# Altium project openmv-ae3.PrjPcb (part 2 of 2)

## Sheet wifi-bt.SchDoc
size A
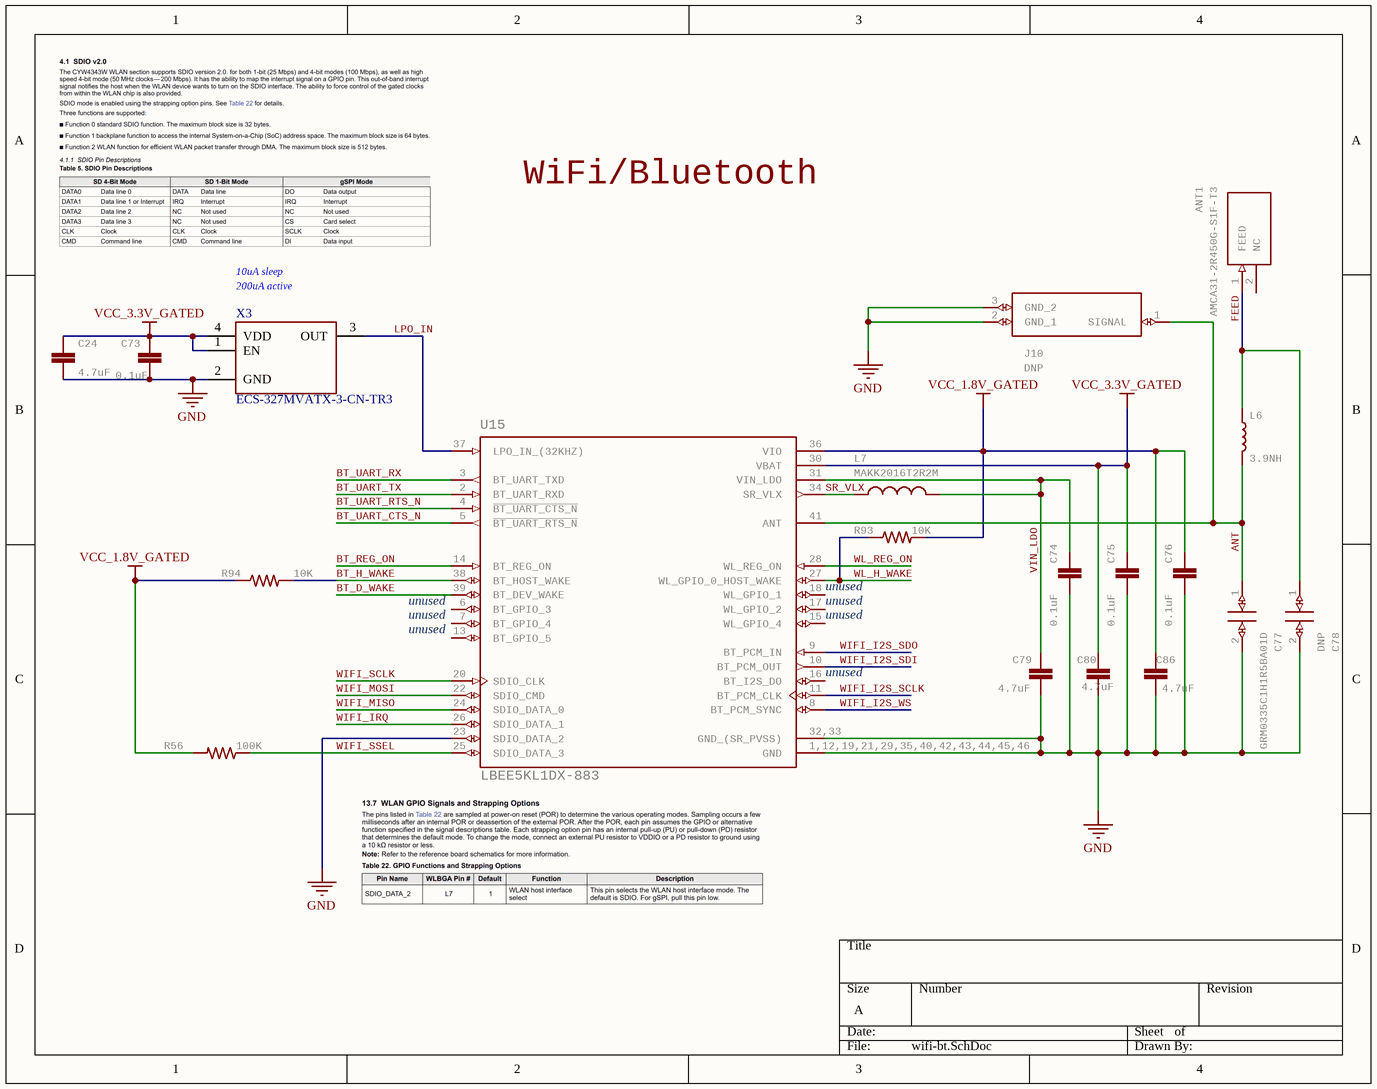
[diagram p13: wifi-bt.SchDoc]

### Parts
ANT1  AMCA31-2R450G-S1F-T3  [ANTC3216X140N]
C24  4.7uF  [0402-CAP]
C73  0.1uF  [0402-CAP]
C74  0.1uF  [0402-CAP]
C75  0.1uF  [0402-CAP]
C76  0.1uF  [0402-CAP]
C77  GRM0335C1H1R5BA01D  [CAPC0603X33N]
C78  DNP  [C0201-NO-3D]
C79  4.7uF  [0402-CAP]
C80  4.7uF  [0402-CAP]
C86  4.7uF  [0402-CAP]
J10  DNP  [23370191-NO-3D]
L6  3.9NH  [0402]
L7  MAKK2016T2R2M  [INDC2016X100N]
R56  100K  [0402-RES]
R93  10K  [0402-RES]
R94  10K  [0402-RES]
U15  LBEE5KL1DX-883  [XCVR_LBEE5KL1DX-TEMP]
X3  ECS-327MVATX-3-CN-TR3  [XTAL_3225]

### Nets
GND: C24.1 C73.2 C74.2 C75.2 C76.2 C77.2 C78.2 C79.1 C80.1 C86.1 J10.2(GND_1) J10.3(GND_2) U15.1,12,19,21,29,35,40,42,43,44,45,46(GND) U15.23(SDIO_DATA_2) U15.32,33(GND_(SR_PVSS)) X3.2(GND)
VCC_1.8V_GATED: C76.1 C86.2 R56.2 R93.2 R94.1 U15.36(VIO)
VCC_3.3V_GATED: C24.2 C73.1 C75.1 C80.2 U15.30(VBAT) X3.1(EN) X3.4(VDD)
ANT: C77.1 J10.1(SIGNAL) L6.2 U15.41(ANT)
BT_D_WAKE: U15.39(BT_DEV_WAKE)
BT_H_WAKE: R94.2 U15.38(BT_HOST_WAKE)
BT_REG_ON: U15.14(BT_REG_ON)
BT_UART_CTS_N: U15.5(~{BT_UART_RTS_N})
BT_UART_RTS_N: U15.4(~{BT_UART_CTS_N})
BT_UART_RX: U15.3(BT_UART_TXD)
BT_UART_TX: U15.2(BT_UART_RXD)
FEED: ANT1.1(FEED) C78.1 L6.1
LPO_IN: U15.37(LPO_IN_(32KHZ)) X3.3(OUT)
SR_VLX: L7.1 U15.34(SR_VLX)
VIN_LDO: C74.1 C79.2 L7.2 U15.31(VIN_LDO)
WIFI_I2S_SCLK: U15.11(BT_PCM_CLK)
WIFI_I2S_SDI: U15.10(BT_PCM_OUT)
WIFI_I2S_SDO: U15.9(BT_PCM_IN)
WIFI_I2S_WS: U15.8(BT_PCM_SYNC)
WIFI_IRQ: U15.26(SDIO_DATA_1)
WIFI_MISO: U15.24(SDIO_DATA_0)
WIFI_MOSI: U15.22(SDIO_CMD)
WIFI_SCLK: U15.20(SDIO_CLK)
WIFI_SSEL: R56.1 U15.25(SDIO_DATA_3)
WL_H_WAKE: R93.1 U15.27(WL_GPIO_0_HOST_WAKE)
WL_REG_ON: U15.28(WL_REG_ON)

Not connected (* = marked no-connect by the designer): ANT1 2(NC); U15 6(BT_GPIO_3) 7(BT_GPIO_4) 13(BT_GPIO_5) 15(WL_GPIO_4) 16(BT_I2S_DO) 17(WL_GPIO_2) 18(WL_GPIO_1)

### Notes on the sheet
- WiFi/Bluetooth
- 10uA sleep
- (near X3) 200uA active
- (near U15) unused
- unused

### Library data of the parts
ANT1 = AMCA31-2R450G-S1F-T3: ABRACON - AMCA31-2R450G-S1F-T3 - ANTENNA, CHIP, 2.45GHZ, 50 OHM, 1206   Source:  Datasheet; GateName_1: G$1; SymbolName_1: AMCA31-2R450G-S1F-T3; LibraryName: AMCA31-2R450G-S1F-T3; DeviceSetName: AMCA31-2R450G-S1F-T3; HEIGHT: 1.4mm; MANUFACTURER_NAME: ABRACON; MANUFACTURER_PART_NUMBER: AMCA31-2R450G-S1F-T3; MOUSER_PART_NUMBER: 815-CA312R450GS1FT3; MOUSER_PRICE-STOCK: https://www.mouser.co.uk/ProductDetail/ABRACON/AMCA31-2R450G-S1F-T3?qs=AAveGqk956GLuOddQEK40Q%3D%3D; MPN: AMCA31-2R450G-S1F-T3; Part Number: AMCA31-2R450G-S1F-T3
C24 C79 C80 C86 = CAP0402-CAP: as C30 on sheet usb; DeviceName: 0402-CAP; LibraryName: sfe; DeviceSetName: CAP; Part Number: JMK105BBJ475MV-F
C73-C76 = C-EUC0201: CAPACITOR, European symbol; MPN: C0402C104Z4VAC; GateName_1: G$1; SymbolName_1: C-EU; POPULARITY: 0; LibraryName: rcl; DeviceSetName: C-EU; SPICEPREFIX: C; Part Number: C0402C104Z4VAC
C77 = GRM0335C1H1R5BA01D: Chip Capacitor value 1R5   Source:  Datasheet; MANUFACTURER_NAME: Murata Electronics; GateName_1: G$1; SymbolName_1: GRM0335C1H1R5BA01D; LibraryName: GRM0335C1H1R5BA01D; DeviceSetName: GRM0335C1H1R5BA01D; HEIGHT: 0.33mm; MANUFACTURER_PART_NUMBER: GRM0335C1H1R5BA01D; MOUSER_PART_NUMBER: 81-GRM0335C1H1R5BA1D; MOUSER_PRICE-STOCK: https://www.mouser.co.uk/ProductDetail/Murata-Electronics/GRM0335C1H1R5BA01D?qs=7vGxPDjevFPFqveGwv%252BPUQ%3D%3D; MPN: GRM0335C1H1R5BA01D; Part Number: GRM0335C1H1R5BA01D
C78 = GRM0335C1H1R5BA01D: Chip Capacitor value 1R5   Source:  Datasheet; MANUFACTURER_NAME: Murata Electronics; GateName_1: G$1; POPULATE: 0; SymbolName_1: GRM0335C1H1R5BA01D; LibraryName: GRM0335C1H1R5BA01D; DeviceSetName: GRM0335C1H1R5BA01D; HEIGHT: 0.33mm; MANUFACTURER_PART_NUMBER: GRM0335C1H1R5BA01D; MOUSER_PART_NUMBER: 81-GRM0335C1H1R5BA1D; MOUSER_PRICE-STOCK: https://www.mouser.co.uk/ProductDetail/Murata-Electronics/GRM0335C1H1R5BA01D?qs=7vGxPDjevFPFqveGwv%252BPUQ%3D%3D; MPN: DNP; Part Number: DNP
J10 = 2337019-1: RF Connectors / Coaxial Connectors MicroCoax receptacle UMCC Gen 1   Source:  Datasheet; MANUFACTURER_NAME: TE Connectivity; GateName_1: G$1; POPULATE: 0; SymbolName_1: 2337019-1; LibraryName: 2337019-1; DeviceSetName: 2337019-1; HEIGHT: 1.4mm; MANUFACTURER_PART_NUMBER: 2337019-1; MOUSER_PART_NUMBER: 571-2337019-1; MOUSER_PRICE-STOCK: https://www.mouser.co.uk/ProductDetail/TE-Connectivity/2337019-1?qs=l4Gc20tDgJIuN7nS9rJkJw%3D%3D; MPN: DNP; Part Number: DNP
L6 = INDUCTOR-0402-3.9NH: Inductors    Resist changes in electrical current. Basically a coil of wire.   SparkFun Products:  SparkFun Load Cell Amplifier - HX711  IOIO-OTG - V2.2; MPN: L-07C3N9SV6T; GateName_1: G$1; PROD_ID: NDUC-13457; SymbolName_1: INDUCTOR; DeviceName: -0402-3.9NH; LibraryName: SparkFun-Coils; DeviceSetName: INDUCTOR; Part Number: L-07C3N9SV6T
L7 = MAKK2016T2R2M: INDUCTOR, METAL CORE Check availability; GateName_1: G$1; MF: Taiyo Yuden; SymbolName_1: MAKK2016T2R2M; LibraryName: MAKK2016T2R2M; DeviceSetName: MAKK2016T2R2M; AVAILABILITY: In Stock; MP: MAKK2016T2R2M; MPN: MAKK2016T2R2M; PACKAGE: 2016 Taiyo Yuden; PRICE: None; PURCHASE-URL: https://pricing.snapeda.com/search/part/MAKK2016T2R2M/?ref=eda; Part Number: MAKK2016T2R2M
R56 = RESISTOR0402-RES: as R29 on sheet prg-flash; SymbolName_1: RESISTOR; DeviceName: 0402-RES; LibraryName: sfe; DeviceSetName: RESISTOR; Part Number: AC0402FR-07100KL
R93 R94 = RESISTOR0402-RES: ResistorBasic schematic elements and footprints for 0603, 1206, and PTH resistors.; MPN: AC0402FR-1310K; GateName_1: G$1; SymbolName_1: RESISTOR; DeviceName: 0402-RES; LibraryName: sfe; DeviceSetName: RESISTOR; Part Number: AC0402FR-1310K
U15 = LBEE5KL1DX-TEMP: Broadcom Chipset for 802.11b/g/n + Bluetooth 4.1/EDR; GateName_1: G$1; MF: Murata Electronics; SymbolName_1: LBEE5KL1DX-TEMP; LibraryName: LBEE5KL1DX-TEMP; DeviceSetName: LBEE5KL1DX-TEMP; AVAILABILITY: Unavailable; MP: LBEE5KL1DX-TEMP; MPN: LBEE5KL1DX-883; PACKAGE: None; PRICE: None; Part Number: LBEE5KL1DX-883
X3 = ECS-327MVATX-3-CN-TR3: Part Number: ECS-327MVATX-3-CN-TR3; MPN: ECS-327MVATX-3-CN-TR3

## Sheet mic.SchDoc
size A
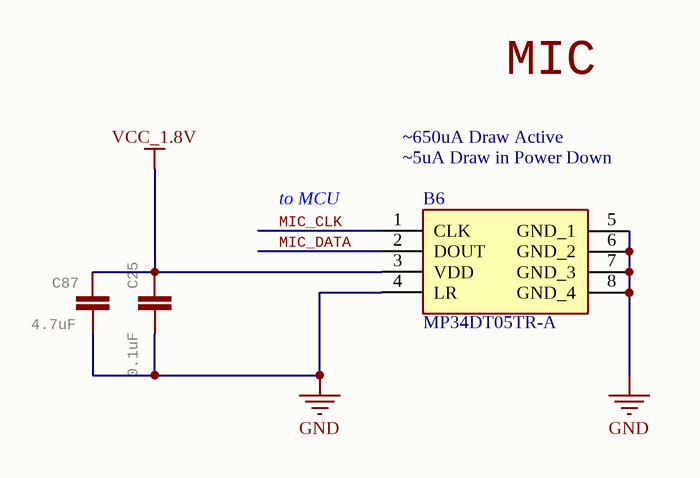
[diagram p14: mic.SchDoc]

### Parts
B6  MP34DT05TR-A  [MP34DT05TRA]
C25  0.1uF  [0402-CAP]
C87  4.7uF  [0402-CAP]

### Nets
GND: B6.4(LR) B6.5(GND_1) B6.6(GND_2) B6.7(GND_3) B6.8(GND_4) C25.2 C87.1
VCC_1.8V: B6.3(VDD) C25.1 C87.2
MIC_CLK: B6.1(CLK)
MIC_DATA: B6.2(DOUT)

### Notes on the sheet
- (near B6) ~5uA Draw in Power Down
- ~650uA Draw Active
- MIC
- to MCU

### Library data of the parts
B6 = MP34DT05TR-A: STMICROELECTRONICS - MP34DT05TR-A - MEMS MICROPHONE, 3.6V, HCLGA-4; Geometry.Height: 1mm; Mouser Part Number: 511-MP34DT05TR-A; Mouser Price/Stock: https://www.mouser.co.uk/ProductDetail/STMicroelectronics/MP34DT05TR-A?qs=BZBei1rCqCAMJfcA0UxAnA%3D%3D; Manufacturer_Name: STMicroelectronics; Manufacturer_Part_Number: MP34DT05TR-A; Datasheet Link: http://www.st.com/content/ccc/resource/technical/document/datasheet/group3/c7/90/d3/f6/b7/e7/40/c8/DM00415595/files/DM00415595.pdf/jcr:content/translations/en.DM00415595.pdf; Part Number: MP34DT05TR-A; MPN: MP34DT05TR-A
C25 = C-EUC0201: as C73 on sheet wifi-bt; LibraryName: rcl; DeviceSetName: C-EU; SPICEPREFIX: C; Part Number: C0402C104Z4VAC
C87 = CAP0402-CAP: as C30 on sheet usb; DeviceName: 0402-CAP; LibraryName: sfe; DeviceSetName: CAP; Part Number: JMK105BBJ475MV-F

## Sheet ae302f.SchDoc
size C
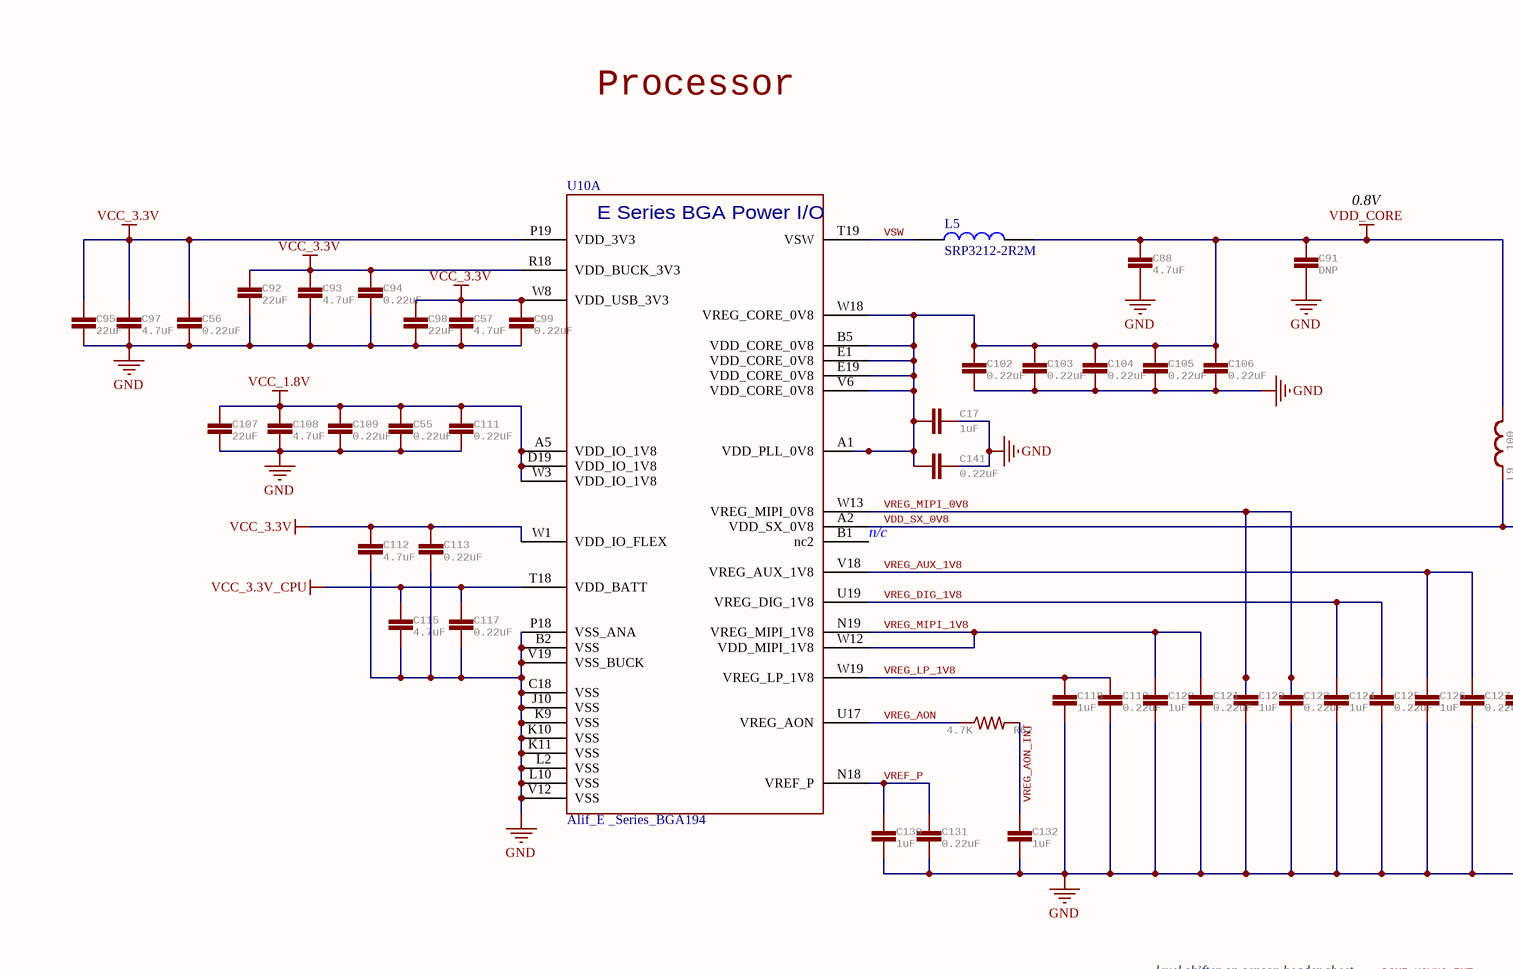
[diagram p15: ae302f.SchDoc, top left]
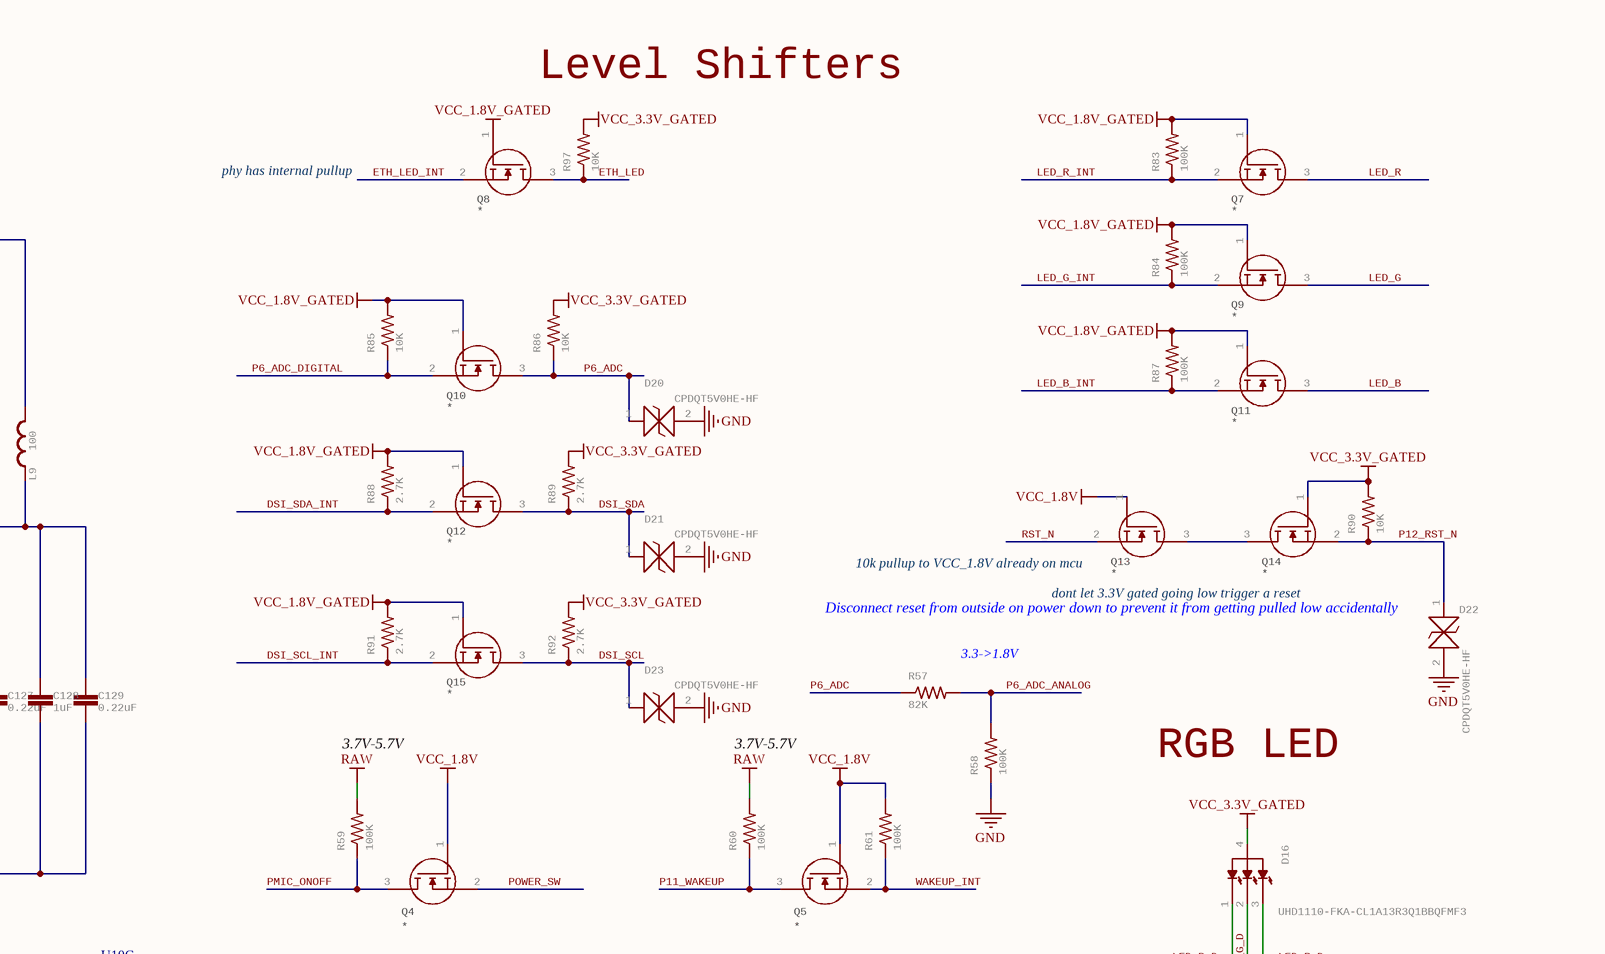
[diagram p16: ae302f.SchDoc, top right]
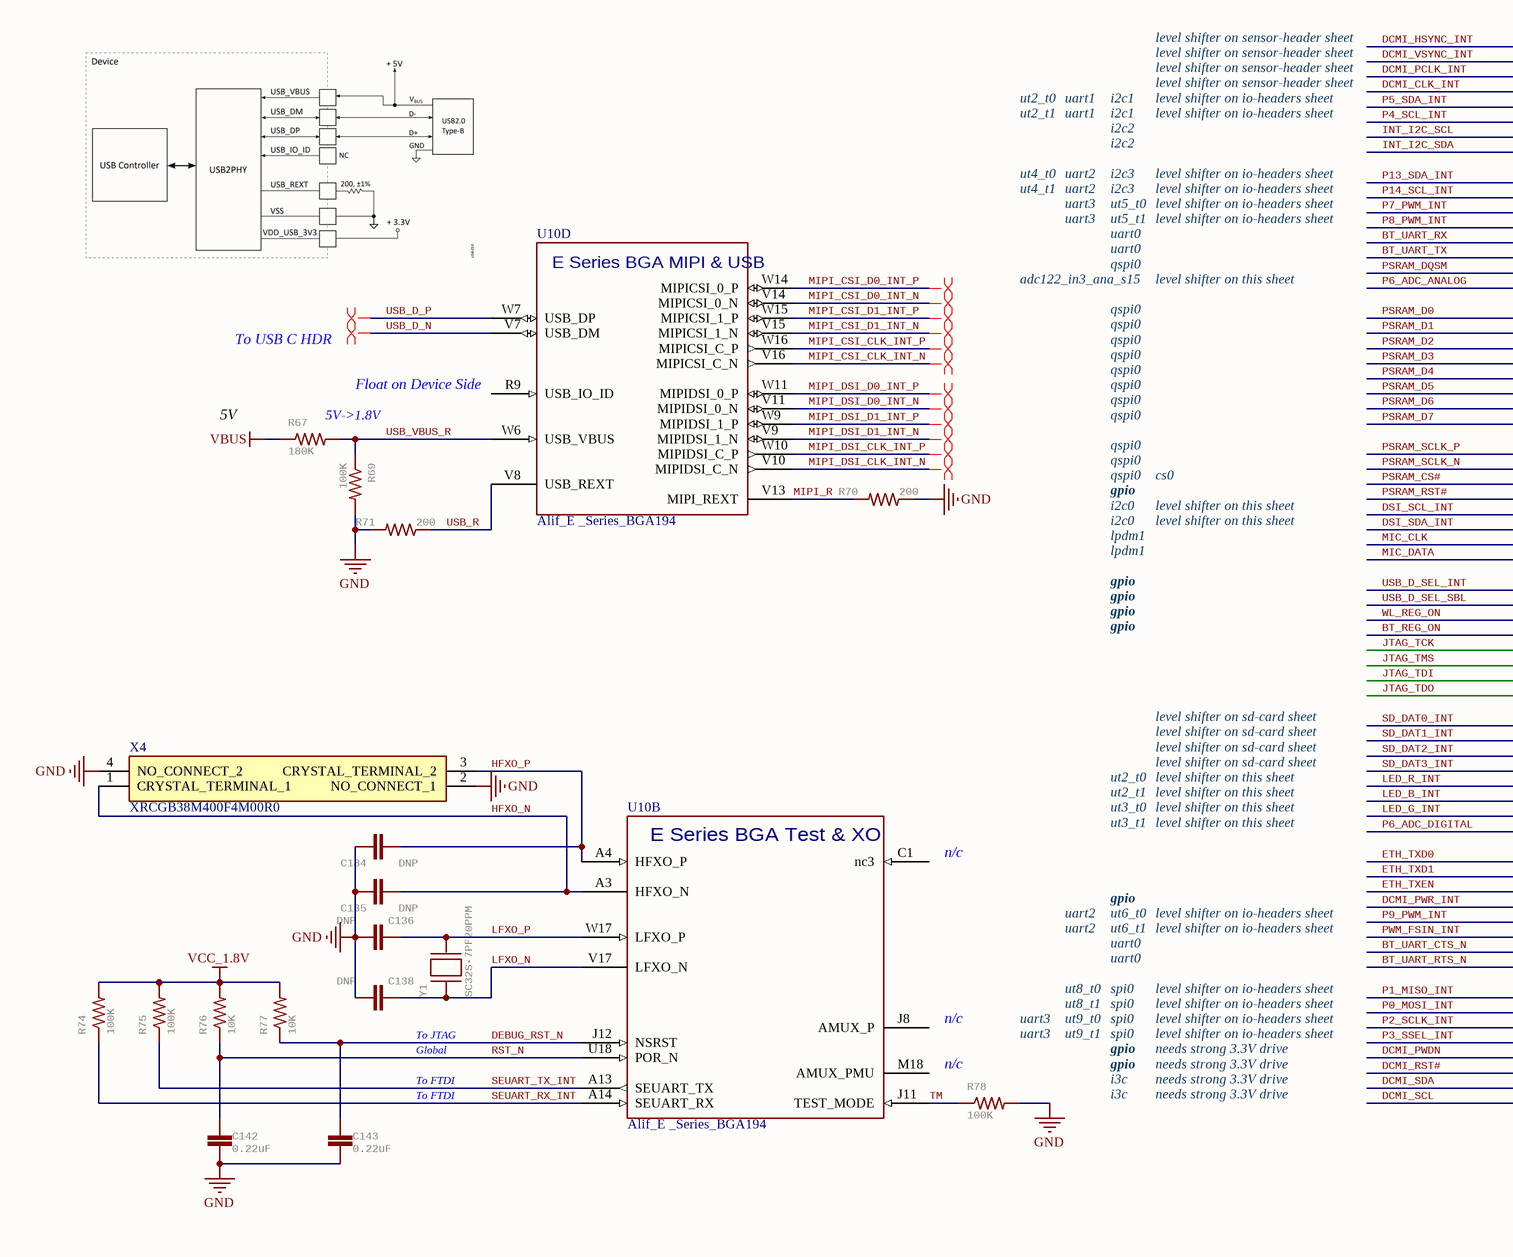
[diagram p17: ae302f.SchDoc, bottom left]
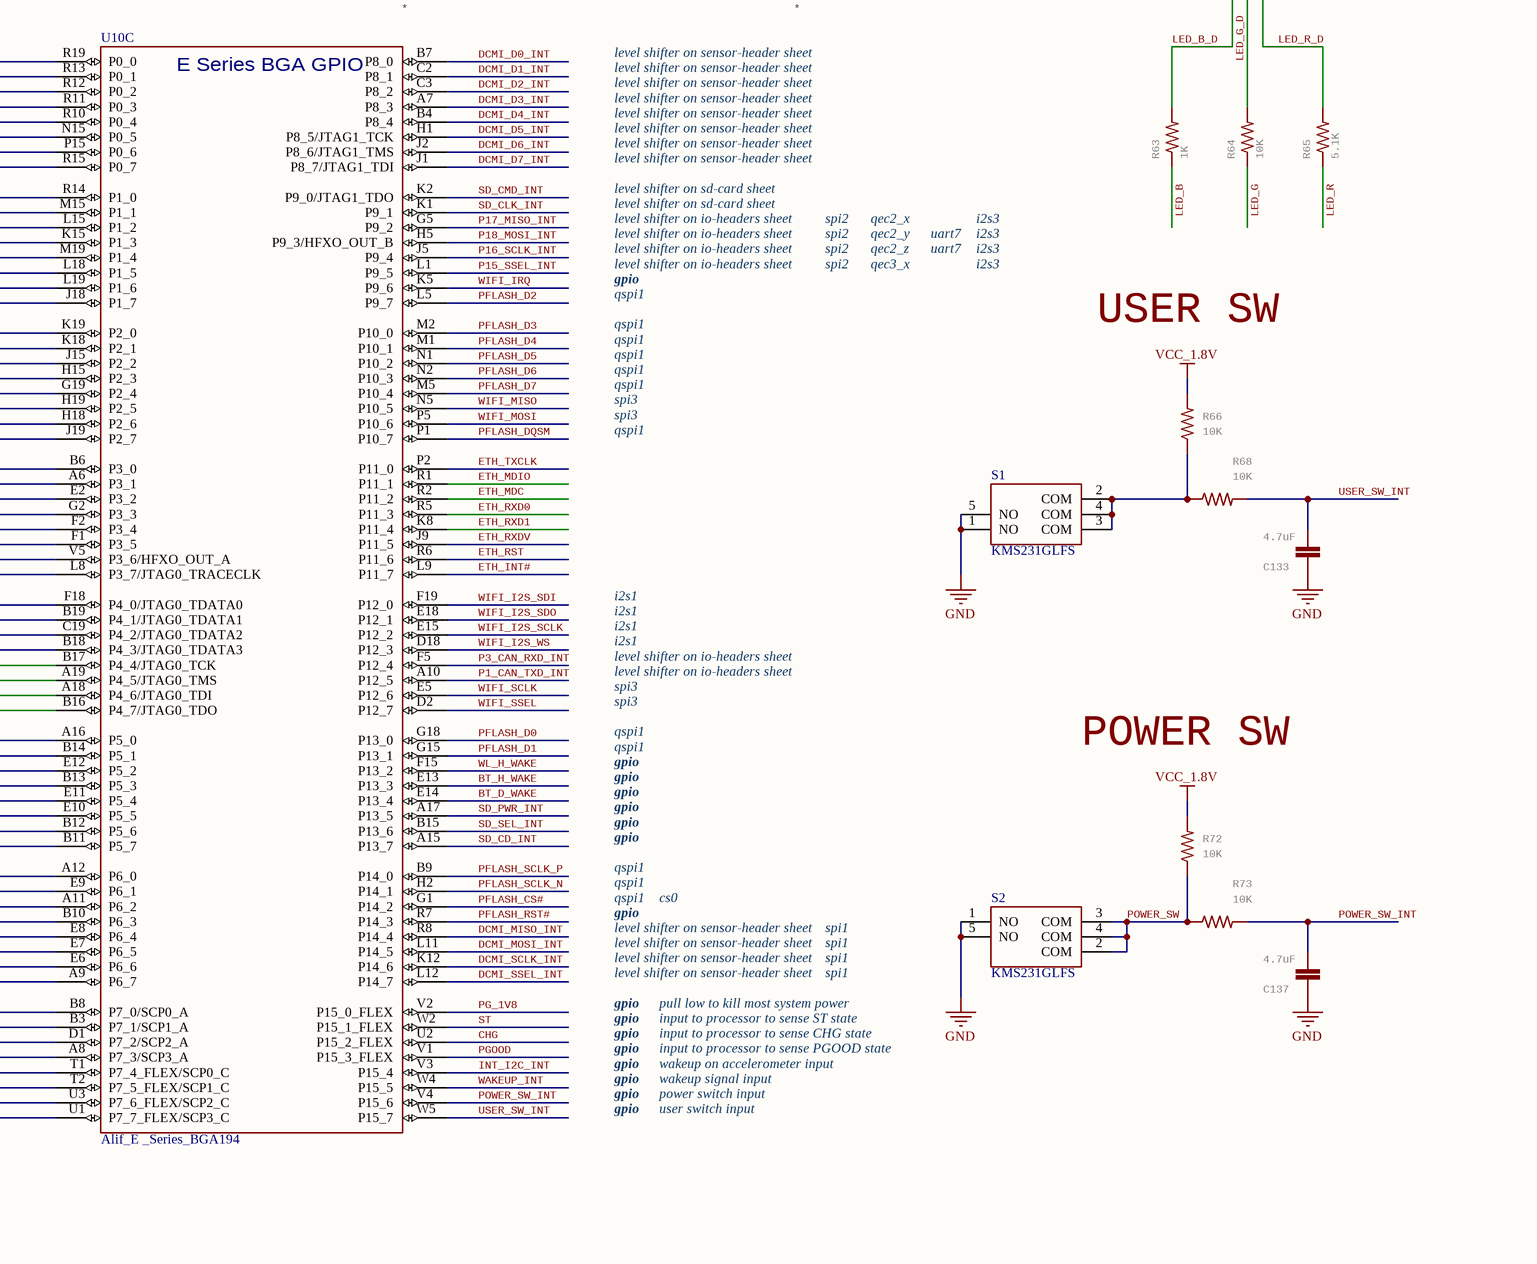
[diagram p18: ae302f.SchDoc, bottom right]

### Parts
C17  1uF  [0402-CAP]
C55  0.22uF  [C0201]
C56  0.22uF  [C0201]
C57  4.7uF  [0402-CAP]
C88  4.7uF  [0402-CAP]
C91  DNP  [0805]
C92  22uF  [0805]
C93  4.7uF  [0402-CAP]
C94  0.22uF  [C0201]
C95  22uF  [0805]
C97  4.7uF  [0402-CAP]
C98  22uF  [0805]
C99  0.22uF  [C0201]
C102  0.22uF  [C0201]
C103  0.22uF  [C0201]
C104  0.22uF  [C0201]
C105  0.22uF  [C0201]
C106  0.22uF  [C0201]
C107  22uF  [0805]
C108  4.7uF  [0402-CAP]
C109  0.22uF  [C0201]
C111  0.22uF  [C0201]
C112  4.7uF  [0402-CAP]
C113  0.22uF  [C0201]
C115  4.7uF  [0402-CAP]
C117  0.22uF  [C0201]
C118  1uF  [0402-CAP]
C119  0.22uF  [C0201]
C120  1uF  [0402-CAP]
C121  0.22uF  [C0201]
C122  1uF  [0402-CAP]
C123  0.22uF  [C0201]
C124  1uF  [0402-CAP]
C125  0.22uF  [C0201]
C126  1uF  [0402-CAP]
C127  0.22uF  [C0201]
C128  1uF  [0402-CAP]
C129  0.22uF  [C0201]
C130  1uF  [0402-CAP]
C131  0.22uF  [C0201]
C132  1uF  [0402-CAP]
C133  4.7uF  [0402-CAP]
C134  DNP  [C0201]
C135  DNP  [C0201]
C136  DNP  [C0201]
C137  4.7uF  [0402-CAP]
C138  DNP  [C0201]
C141  0.22uF  [C0201]
C142  0.22uF  [C0201]
C143  0.22uF  [C0201]
D16  UHD1110-FKA-CL1A13R3Q1BBQFMF3  [LED_UHD1110-FKA-CL1A13R3Q1BBQFMF3]
D20  CPDQT5V0HE-HF  [CPDQT5V0HEHF]
D21  CPDQT5V0HE-HF  [CPDQT5V0HEHF]
D22  CPDQT5V0HE-HF  [CPDQT5V0HEHF]
D23  CPDQT5V0HE-HF  [CPDQT5V0HEHF]
L5  SRP3212-2R2M  [IND3225X100N]
L9  100  [C0402]
Q4  NMOS  [DFN1006]  (value not drawn)
Q5  NMOS  [DFN1006]  (value not drawn)
Q7  NMOS  [DFN1006]  (value not drawn)
Q8  NMOS  [DFN1006]  (value not drawn)
Q9  NMOS  [DFN1006]  (value not drawn)
Q10  NMOS  [DFN1006]  (value not drawn)
Q11  NMOS  [DFN1006]  (value not drawn)
Q12  NMOS  [DFN1006]  (value not drawn)
Q13  NMOS  [DFN1006]  (value not drawn)
Q14  NMOS  [DFN1006]  (value not drawn)
Q15  NMOS  [DFN1006]  (value not drawn)
R57  82K  [R0201]
R58  100K  [R0201]
R59  100K  [0402-RES]
R60  100K  [R0201]
R61  100K  [R0201]
R62  4.7K  [0402-RES]
R63  1K  [R0201]
R64  10K  [R0201]
R65  5.1K  [R0201]
R66  10K  [0402-RES]
R67  180K  [R0201]
R68  10K  [0402-RES]
R69  100K  [R0201]
R70  200  [R0201]
R71  200  [R0201]
R72  10K  [0402-RES]
R73  10K  [0402-RES]
R74  100K  [R0201]
R75  100K  [R0201]
R76  10K  [R0201]
R77  10K  [R0201]
R78  100K  [r0201]
R83  100K  [R0201]
R84  100K  [R0201]
R85  10K  [R0201]
R86  10K  [R0201]
R87  100K  [R0201]
R88  2.7K  [R0201]
R89  2.7K  [R0201]
R90  10K  [R0201]
R91  2.7K  [R0201]
R92  2.7K  [R0201]
R97  10K  [R0201]
S1  KMS231GLFS  [KMS231GLFS]
S2  KMS231GLFS  [KMS231GLFS]
U10  Alif_E _Series_BGA194  [BGA194 _CENTERED]  (parts A,B,C,D of 4)
X4  XRCGB38M400F4M00R0  [XTAL_2016]
Y1  SC32S-7PF20PPM  [XTAL_ABS07-32.768KHZ-7-T]

### Nets
GND: C17.2 C55.1 C56.1 C57.2 C88.2 C91.1 C92.1 C93.2 C94.1 C95.1 C97.2 C98.1 C99.1 C102.1 C103.1 C104.1 C105.1 C106.1 C107.1 C108.2 C109.1 C111.1 C112.2 C113.1 C115.2 C117.1 C118.2 C119.1 C120.2 C121.1 C122.2 C123.1 C124.2 C125.1 C126.2 C127.2 C128.2 C129.1 C130.2 C131.1 C132.2 C133.1 C134.1 C135.1 C136.2 C137.1 C138.2 C141.1 C142.1 C143.1 D20.2 D21.2 D22.2 D23.2 R58.1 R69.2 R70.1 R71.2 R78.2 S1.1(NO) S1.5(NO) S2.1(NO) S2.5(NO) U10.B2(VSS) U10.C18(VSS) U10.J10(VSS) U10.K9(VSS) U10.K10(VSS) U10.K11(VSS) U10.L2(VSS) U10.L10(VSS) U10.P18(VSS_ANA) U10.V12(VSS) U10.V19(VSS_BUCK) X4.2(NO_CONNECT_1) X4.4(NO_CONNECT_2)
RAW: R59.2 R60.2
VBUS: R67.1
VCC_1.8V: C55.2 C107.2 C108.1 C109.2 C111.2 Q4.1(G) Q5.1(G) Q13.1(G) R61.2 R66.2 R72.2 R74.2 R75.2 R76.2 R77.2 U10.A5(VDD_IO_1V8) U10.D19(VDD_IO_1V8) U10.W3(VDD_IO_1V8)
VCC_1.8V_GATED: Q7.1(G) Q8.1(G) Q9.1(G) Q10.1(G) Q11.1(G) Q12.1(G) Q15.1(G) R83.2 R84.2 R85.2 R87.2 R88.2 R91.2
VCC_3.3V: C56.2 C57.1 C92.2 C93.1 C94.2 C95.2 C97.1 C98.2 C99.2 C112.1 C113.2 U10.P19(VDD_3V3) U10.R18(VDD_BUCK_3V3) U10.W1(VDD_IO_FLEX) U10.W8(VDD_USB_3V3)
VCC_3.3V_CPU: C115.1 C117.2 U10.T18(VDD_BATT)
VCC_3.3V_GATED: D16.4(ANODE) Q14.1(G) R86.2 R89.2 R90.2 R92.2 R97.2
VDD_CORE: C17.1 C88.1 C91.2 C102.2 C103.2 C104.2 C105.2 C106.2 C141.2 L5.2 L9.2 U10.A1(VDD_PLL_0V8) U10.B5(VDD_CORE_0V8) U10.E1(VDD_CORE_0V8) U10.E19(VDD_CORE_0V8) U10.V6(VDD_CORE_0V8) U10.W18(VREG_CORE_0V8)
BT_D_WAKE: U10.E14(P13_4)
BT_H_WAKE: U10.E13(P13_3)
BT_REG_ON: U10.B18(P4_3/JTAG0_TDATA3)
BT_UART_CTS_N: U10.E6(P6_6)
BT_UART_RTS_N: U10.A9(P6_7)
BT_UART_RX: U10.M19(P1_4)
BT_UART_TX: U10.L18(P1_5)
CHG: U10.U2(P15_2_FLEX)
DCMI_CLK_INT: U10.R11(P0_3)
DCMI_D0_INT: U10.B7(P8_0)
DCMI_D1_INT: U10.C2(P8_1)
DCMI_D2_INT: U10.C3(P8_2)
DCMI_D3_INT: U10.A7(P8_3)
DCMI_D4_INT: U10.B4(P8_4)
DCMI_D5_INT: U10.H1(P8_5/JTAG1_TCK)
DCMI_D6_INT: U10.J2(P8_6/JTAG1_TMS)
DCMI_D7_INT: U10.J1(P8_7/JTAG1_TDI)
DCMI_HSYNC_INT: U10.R19(P0_0)
DCMI_MISO_INT: U10.R8(P14_4)
DCMI_MOSI_INT: U10.L11(P14_5)
DCMI_PCLK_INT: U10.R12(P0_2)
DCMI_PWDN: U10.T1(P7_4_FLEX/SCP0_C)
DCMI_PWR_INT: U10.B10(P6_3)
DCMI_RST#: U10.T2(P7_5_FLEX/SCP1_C)
DCMI_SCL: U10.U1(P7_7_FLEX/SCP3_C)
DCMI_SCLK_INT: U10.K12(P14_6)
DCMI_SDA: U10.U3(P7_6_FLEX/SCP2_C)
DCMI_SSEL_INT: U10.L12(P14_7)
DCMI_VSYNC_INT: U10.R13(P0_1)
DEBUG_RST_N: C143.2 R77.1 U10.J12(NSRST)
DSI_SCL: D23.1 Q15.3(D) R92.1
DSI_SCL_INT: Q15.2(S) R91.1 U10.F2(P3_4)
DSI_SDA: D21.1 Q12.3(D) R89.1
DSI_SDA_INT: Q12.2(S) R88.1 U10.F1(P3_5)
ETH_INT#: U10.L9(P11_7)
ETH_LED: Q8.3(D) R97.1
ETH_LED_INT: Q8.2(S)
ETH_MDC: U10.R2(P11_2)
ETH_MDIO: U10.R1(P11_1)
ETH_RST: U10.R6(P11_6)
ETH_RXD0: U10.R5(P11_3)
ETH_RXD1: U10.K8(P11_4)
ETH_RXDV: U10.J9(P11_5)
ETH_TXCLK: U10.P2(P11_0)
ETH_TXD0: U10.A12(P6_0)
ETH_TXD1: U10.E9(P6_1)
ETH_TXEN: U10.A11(P6_2)
HFXO_N: C135.2 U10.A3(HFXO_N) X4.1(CRYSTAL_TERMINAL_1)
HFXO_P: C134.2 U10.A4(HFXO_P) X4.3(CRYSTAL_TERMINAL_2)
INT_I2C_INT: U10.V3(P15_4)
INT_I2C_SCL: U10.P15(P0_6)
INT_I2C_SDA: U10.R15(P0_7)
JTAG_TCK: U10.B17(P4_4/JTAG0_TCK)
JTAG_TDI: U10.A18(P4_6/JTAG0_TDI)
JTAG_TDO: U10.B16(P4_7/JTAG0_TDO)
JTAG_TMS: U10.A19(P4_5/JTAG0_TMS)
LED_B: Q11.3(D) R63.1
LED_B_D: D16.1(BLUE) R63.2
LED_B_INT: Q11.2(S) R87.1 U10.E10(P5_5)
LED_G: Q9.3(D) R64.1
LED_G_D: D16.2(GREEN) R64.2
LED_G_INT: Q9.2(S) R84.1 U10.B12(P5_6)
LED_R: Q7.3(D) R65.1
LED_R_D: D16.3(RED) R65.2
LED_R_INT: Q7.2(S) R83.1 U10.E11(P5_4)
LFXO_N: C138.1 U10.V17(LFXO_N) Y1.1
LFXO_P: C136.1 U10.W17(LFXO_P) Y1.2
MIC_CLK: U10.V5(P3_6/HFXO_OUT_A)
MIC_DATA: U10.L8(P3_7/JTAG0_TRACECLK)
MIPI_CSI_CLK_INT_N: U10.V16(MIPICSI_C_N)
MIPI_CSI_CLK_INT_P: U10.W16(MIPICSI_C_P)
MIPI_CSI_D0_INT_N: U10.V14(MIPICSI_0_N)
MIPI_CSI_D0_INT_P: U10.W14(MIPICSI_0_P)
MIPI_CSI_D1_INT_N: U10.V15(MIPICSI_1_N)
MIPI_CSI_D1_INT_P: U10.W15(MIPICSI_1_P)
MIPI_DSI_CLK_INT_N: U10.V10(MIPIDSI_C_N)
MIPI_DSI_CLK_INT_P: U10.W10(MIPIDSI_C_P)
MIPI_DSI_D0_INT_N: U10.V11(MIPIDSI_0_N)
MIPI_DSI_D0_INT_P: U10.W11(MIPIDSI_0_P)
MIPI_DSI_D1_INT_N: U10.V9(MIPIDSI_1_N)
MIPI_DSI_D1_INT_P: U10.W9(MIPIDSI_1_P)
MIPI_R: R70.2 U10.V13(MIPI_REXT)
P0_MOSI_INT: U10.B3(P7_1/SCP1_A)
P1_CAN_TXD_INT: U10.A10(P12_5)
P1_MISO_INT: U10.B8(P7_0/SCP0_A)
P2_SCLK_INT: U10.D1(P7_2/SCP2_A)
P3_CAN_RXD_INT: U10.F5(P12_4)
P3_SSEL_INT: U10.A8(P7_3/SCP3_A)
P4_SCL_INT: U10.N15(P0_5)
P5_SDA_INT: U10.R10(P0_4)
P6_ADC: D20.1 Q10.3(D) R57.1 R86.1
P6_ADC_ANALOG: R57.2 R58.2 U10.J18(P1_7)
P6_ADC_DIGITAL: Q10.2(S) R85.1 U10.B11(P5_7)
P7_PWM_INT: U10.L15(P1_2)
P8_PWM_INT: U10.K15(P1_3)
P9_PWM_INT: U10.E8(P6_4)
P11_WAKEUP: Q5.3(D) R60.1
P12_RST_N: D22.1 Q14.2(S) R90.1
P13_SDA_INT: U10.R14(P1_0)
P14_SCL_INT: U10.M15(P1_1)
P15_SSEL_INT: U10.L1(P9_5)
P16_SCLK_INT: U10.J5(P9_4)
P17_MISO_INT: U10.G5(P9_2)
P18_MOSI_INT: U10.H5(P9_3/HFXO_OUT_B)
PFLASH_CS#: U10.G1(P14_2)
PFLASH_D0: U10.G18(P13_0)
PFLASH_D1: U10.G15(P13_1)
PFLASH_D2: U10.L5(P9_7)
PFLASH_D3: U10.M2(P10_0)
PFLASH_D4: U10.M1(P10_1)
PFLASH_D5: U10.N1(P10_2)
PFLASH_D6: U10.N2(P10_3)
PFLASH_D7: U10.M5(P10_4)
PFLASH_DQSM: U10.P1(P10_7)
PFLASH_RST#: U10.R7(P14_3)
PFLASH_SCLK_N: U10.H2(P14_1)
PFLASH_SCLK_P: U10.B9(P14_0)
PG_1V8: U10.V2(P15_0_FLEX)
PGOOD: U10.V1(P15_3_FLEX)
PMIC_ONOFF: Q4.3(D) R59.1
POWER_SW: Q4.2(S) R72.1 R73.1 S2.2(COM) S2.3(COM) S2.4(COM)
POWER_SW_INT: C137.2 R73.2 U10.V4(P15_6)
PSRAM_CS#: U10.E2(P3_2)
PSRAM_D0: U10.K19(P2_0)
PSRAM_D1: U10.K18(P2_1)
PSRAM_D2: U10.J15(P2_2)
PSRAM_D3: U10.H15(P2_3)
PSRAM_D4: U10.G19(P2_4)
PSRAM_D5: U10.H19(P2_5)
PSRAM_D6: U10.H18(P2_6)
PSRAM_D7: U10.J19(P2_7)
PSRAM_DQSM: U10.L19(P1_6)
PSRAM_RST#: U10.G2(P3_3)
PSRAM_SCLK_N: U10.A6(P3_1)
PSRAM_SCLK_P: U10.B6(P3_0)
PWM_FSIN_INT: U10.E7(P6_5)
RST_N: C142.2 Q13.2(S) R76.1 U10.U18(POR_N)
SD_CD_INT: U10.A15(P13_7)
SD_CLK_INT: U10.K1(P9_1)
SD_CMD_INT: U10.K2(P9_0/JTAG1_TDO)
SD_DAT0_INT: U10.A16(P5_0)
SD_DAT1_INT: U10.B14(P5_1)
SD_DAT2_INT: U10.E12(P5_2)
SD_DAT3_INT: U10.B13(P5_3)
SD_PWR_INT: U10.A17(P13_5)
SD_SEL_INT: U10.B15(P13_6)
SEUART_RX_INT: R74.1 U10.A14(SEUART_RX)
SEUART_TX_INT: R75.1 U10.A13(SEUART_TX)
ST: U10.W2(P15_1_FLEX)
TM: R78.1 U10.J11(TEST_MODE)
USB_D_N: U10.V7(USB_DM)
USB_D_P: U10.W7(USB_DP)
USB_D_SEL_INT: U10.F18(P4_0/JTAG0_TDATA0)
USB_D_SEL_SBL: U10.B19(P4_1/JTAG0_TDATA1)
USB_R: R71.1 U10.V8(USB_REXT)
USB_VBUS_R: R67.2 R69.1 U10.W6(USB_VBUS)
USER_SW_INT: C133.2 R68.2 U10.W5(P15_7)
VDD_SX_0V8: C128.1 C129.2 L9.1 U10.A2(VDD_SX_0V8)
VREF_P: C130.1 C131.2 U10.N18(VREF_P)
VREG_AON: R62.1 U10.U17(VREG_AON)
VREG_AON_INT: C132.1 R62.2
VREG_AUX_1V8: C126.1 C127.1 U10.V18(VREG_AUX_1V8)
VREG_DIG_1V8: C124.1 C125.2 U10.U19(VREG_DIG_1V8)
VREG_LP_1V8: C118.1 C119.2 U10.W19(VREG_LP_1V8)
VREG_MIPI_0V8: C122.1 C123.2 U10.W13(VREG_MIPI_0V8)
VREG_MIPI_1V8: C120.1 C121.2 U10.N19(VREG_MIPI_1V8) U10.W12(VDD_MIPI_1V8)
VSW: L5.1 U10.T19(VSW)
WAKEUP_INT: Q5.2(S) R61.1 U10.W4(P15_5)
WIFI_I2S_SCLK: U10.E15(P12_2)
WIFI_I2S_SDI: U10.F19(P12_0)
WIFI_I2S_SDO: U10.E18(P12_1)
WIFI_I2S_WS: U10.D18(P12_3)
WIFI_IRQ: U10.K5(P9_6)
WIFI_MISO: U10.N5(P10_5)
WIFI_MOSI: U10.P5(P10_6)
WIFI_SCLK: U10.E5(P12_6)
WIFI_SSEL: U10.D2(P12_7)
WL_H_WAKE: U10.F15(P13_2)
WL_REG_ON: U10.C19(P4_2/JTAG0_TDATA2)
NetQ13_3: Q13.3(D) Q14.3(D)
NetR66_1: R66.1 R68.1 S1.2(COM) S1.3(COM) S1.4(COM)

Not connected (* = marked no-connect by the designer): U10 B1(nc2) C1(nc3) J8(AMUX_P) M18(AMUX_PMU) R9(USB_IO_ID)

### Layout directives
differential pair; differential pair class MIPI: MIPI_CSI_CLK_INT_N, MIPI_CSI_CLK_INT_P, MIPI_CSI_D0_INT_N, MIPI_CSI_D0_INT_P, MIPI_CSI_D1_INT_N, MIPI_CSI_D1_INT_P, MIPI_DSI_CLK_INT_N, MIPI_DSI_CLK_INT_P, MIPI_DSI_D0_INT_N, MIPI_DSI_D0_INT_P, MIPI_DSI_D1_INT_N, MIPI_DSI_D1_INT_P, USB_D_N, USB_D_P

### Notes on the sheet
- Processor
- Level Shifters
- 0.8V
- phy has internal pullup
- n/c
- (near Q13) 10k pullup to VCC_1.8V already on mcu
- dont let 3.3V gated going low trigger a reset
- (near D22) Disconnect reset from outside on power down to prevent it from getting pulled low accidentally
- (near R57) 3.3->1.8V
- 3.7V-5.7V
- RGB LED
- level shifter on sensor-header sheet
- ut2_t0
- ut2_t1
- uart1
- i2c1
- level shifter on io-headers sheet
- ut4_t0
- ut4_t1
- uart2
- i2c2
- i2c3
- level shifter on sd-card sheet
- uart3
- uart0
- ut5_t1
- ut5_t0
- qspi0
- gpio
- spi2
- qec2_x
- qec2_y
- qec2_z
- qec3_x
- uart7
- i2s3
- To USB C HDR
- adc122_in3_ana_s15
- level shifter on this sheet
- qspi1
- USER SW
- 5V
- (near R67) 5V->1.8V
- (near U10) Float on Device Side
- spi3
- cs0
- i2c0
- lpdm1
- i2s1
- POWER SW
- ut3_t0
- ut3_t1
- ut6_t0
- ut6_t1
- spi1
- ut8_t0
- ut8_t1
- ut9_t0
- spi0
- input to processor to sense ST state
- input to processor to sense CHG state
- pull low to kill most system power
- To JTAG
- To FTDI
- Global
- (near R78) n/c
- ut9_t1
- i3c
- needs strong 3.3V drive
- input to processor to sense PGOOD state
- power switch input
- user switch input
- wakeup signal input
- wakeup on accelerometer input
- (in symbol E7_Bx_BGA_194_noGNSS, part A) E Series BGA Power I/O
- (in symbol E7_Bx_BGA_194_noGNSS, part B) E Series BGA Test & XO
- (in symbol E7_Bx_BGA_194_noGNSS, part C) E Series BGA GPIO
- (in symbol E7_Bx_BGA_194_noGNSS, part D) E Series BGA MIPI & USB

### Library data of the parts
C17 C118 C120 C122 C124 C126 C128 C130 C132 = CAP0402-CAP: CapacitorStandard 0402 ceramic capacitor, and 0.1" leaded capacitor.; MPN: GRM155R61E105KA12J; GateName_1: G$1; SymbolName_1: CAP; DeviceName: 0402-CAP; LibraryName: sfe; DeviceSetName: CAP; Part Number: GRM155R61E105KA12J
C55 C56 C94 C99 C102-C106 C109 C111 C113 C117 C119 C121 C123 C125 C127 C129 C131 C141-C143 = C-EUC0201: CAPACITOR, European symbol; MPN: GRM033R60J224ME15D; GateName_1: G$1; SymbolName_1: C-EU; POPULARITY: 0; DeviceName: C0201; LibraryName: rcl; DeviceSetName: C-EU; SPICEPREFIX: C; Part Number: GRM033R60J224ME15D
C57 C88 C93 C97 C108 C112 C115 C133 C137 = CAP0402-CAP: CapacitorStandard 0603 ceramic capacitor, and 0.1" leaded capacitor.; MPN: JMK105BBJ475MV-F; GateName_1: G$1; SymbolName_1: CAP; DeviceName: 0402-CAP; LibraryName: sfe; DeviceSetName: CAP; Part Number: JMK105BBJ475MV-F
C91 = 22UF-0805-6.3V-20%: 22ÂµF ceramic capacitors    A capacitor is a passive two-terminal electrical component used to store electrical energy temporarily in an electric field.; GateName_1: G$1; SymbolName_1: CAP; DeviceSetName: 22UF; PROD_ID: CAP-08402; DeviceName: -0805-6.3V-20%; LibraryName: SparkFun-Capacitors; MPN: DNP; Part Number: DNP
C92 C95 C98 C107 = 22UF-0805-6.3V-20%: 22ÂµF ceramic capacitors    A capacitor is a passive two-terminal electrical component used to store electrical energy temporarily in an electric field.; MPN: CL21A226MQQNNNE; GateName_1: G$1; SymbolName_1: CAP; PROD_ID: CAP-08402; DeviceName: -0805-6.3V-20%; LibraryName: SparkFun-Capacitors; DeviceSetName: 22UF; Part Number: CL21A226MQQNNNE
C134-C136 C138 = C-EUC0201: CAPACITOR, European symbol; GateName_1: G$1; SymbolName_1: C-EU; POPULARITY: 0; DeviceName: C0201; LibraryName: rcl; DeviceSetName: C-EU; MPN: DNP; SPICEPREFIX: C; Part Number: DNP
D16 = UHD1110-FKA-CL1A13R3Q1BBQFMF3: LED RGB SMD, SIZE 1 X 1 mm Check availability; GateName_1: G$1; MF: Cree Inc.; SymbolName_1: UHD1110-FKA-CL1A13R3Q1BBQFMF3; LibraryName: UHD1110-FKA-CL1A13R3Q1BBQFMF3; DeviceSetName: UHD1110-FKA-CL1A13R3Q1BBQFMF3; AVAILABILITY: In Stock; MP: UHD1110-FKA-CL1A13R3Q1BBQFMF3; MPN: UHD1110-FKA-CL1A13r3q1BBQFMF3; PACKAGE: 0404 Cree Inc.; PRICE: None; PURCHASE-URL: https://pricing.snapeda.com/search/part/UHD1110-FKA-CL1A13R3Q1BBQFMF3/?ref=eda; Part Number: UHD1110-FKA-CL1A13r3q1BBQFMF3
D20-D23 = CPDQT5V0HE-HF: ESD Suppressors / TVS Diodes DIODE ESD 5VWM 65W 0402/SOD-923F   Source:  Datasheet; MANUFACTURER_NAME: Comchip Technology; GateName_1: G$1; SymbolName_1: CPDQT5V0HE-HF; LibraryName: CPDQT5V0HE-HF; DeviceSetName: CPDQT5V0HE-HF; HEIGHT: 0.42mm; MANUFACTURER_PART_NUMBER: CPDQT5V0HE-HF; MOUSER_PART_NUMBER: MOUSER_PART_NUMBER; MOUSER_PRICE-STOCK: MOUSER_PRICE-STOCK; MPN: CPDQT5V0HE-HF; Part Number: CPDQT5V0HE-HF
L5 = SRP3212-2R2M: Ind,3.2x2.5x1mm,2.2uH?20%,4A,shd; Manufacturer_Name: Bourns; Geometry.Height: 1mm; Mouser Part Number: 652-SRP3212-2R2M; Mouser Price/Stock: https://www.mouser.co.uk/ProductDetail/Bourns/SRP3212-2R2M?qs=t7xnP681wgW9NT%2FfJNx1CA%3D%3D; Manufacturer_Part_Number: SRP3212-2R2M; Datasheet Link: https://www.bourns.com/pdfs/CVH.pdf; Part Number: SRP3212-2R2M; MPN: SRP3212-2R2M
L9 = INDUCTOR0402: InductorsBasic Inductor/Choke - 0603 and 1206. Footprints are not proven and vary greatly between part numbers.; MPN: MFBM1V1005-101-R; GateName_1: G$1; DeviceName: 0402; SymbolName_1: INDUCTOR; LibraryName: sfe; DeviceSetName: INDUCTOR; Part Number: MFBM1V1005-101-R
R57 R58 R60 R61 R67 R69-R71 R74-R78 R83 R84 R87-R89 R91 R92 = RESISTOR0402-RES: GateName_1: G$1; SymbolName_1: RESISTOR; LibraryName: sfe; DeviceSetName: RESISTOR
R59 = RESISTOR0402-RES: ResistorBasic schematic elements and footprints for 0603, 1206, and PTH resistors.; MPN: AC0402FR-07100KL; GateName_1: G$1; SymbolName_1: RESISTOR; DeviceName: 0402-RES; LibraryName: sfe; DeviceSetName: RESISTOR; Part Number: AC0402FR-07100KL
R62 = RESISTOR0402-RES: ResistorBasic schematic elements and footprints for 0603, 1206, and PTH resistors.; MPN: RT0402FRE074K7L; GateName_1: G$1; SymbolName_1: RESISTOR; DeviceName: 0402-RES; LibraryName: sfe; DeviceSetName: RESISTOR; Part Number: RT0402FRE074K7L
R63-R65 R85 R86 R90 R97 = RESISTOR0402-RES: ResistorBasic schematic elements and footprints for 0603, 1206, and PTH resistors.; GateName_1: G$1; SymbolName_1: RESISTOR; LibraryName: sfe; DeviceSetName: RESISTOR
R66 R68 R72 R73 = RESISTOR0402-RES: ResistorBasic schematic elements and footprints for 0603, 1206, and PTH resistors.; MPN: AC0402FR-1310K; GateName_1: G$1; SymbolName_1: RESISTOR; DeviceName: 0402-RES; LibraryName: sfe; DeviceSetName: RESISTOR; Part Number: AC0402FR-1310K
U10 = E7_Bx_BGA_194_noGNSS: IC,Alif E7 MCU, Rev B silicon,BGA194; Manufacturer 1: Alif Semi; Manufacturer Part Number 1: AE302F80F55D5LE; Part Number: AE302F80F55D5LE; MPN: AE302F80F55D5LE
X4 = XRCGB38M400F4M00R0: 2.0X1.6X0.65MM 38.4MHZ CRYSTAL; Manufacturer_Name: Murata Electronics; Geometry.Height: 0.7mm; Mouser Part Number: *; Mouser Price/Stock: *; Manufacturer_Part_Number: XRCGB38M400F4M00R0; Datasheet Link: http://www.murata.com/products/productdata/8801066811422/SPEC-XRCGB38M400F4M00R0.pdf; Part Number: XRCGB38M400F4M00R0; MPN: XRCGB38M400F4M00R0
Y1 = ABS07-32.768KHZ-7-T: Check availability; GateName_1: G$1; MF: Abracon; SymbolName_1: ABS07-32.768KHZ-7-T; LibraryName: ABS07-32.768KHZ-7-T; DeviceSetName: ABS07-32.768KHZ-7-T; AVAILABILITY: In Stock; MP: ABS07-32.768KHZ-7-T; MPN: SC32S-7PF20PPM; PACKAGE: SMD-2 Abracon LLC; PRICE: None; PURCHASE-URL: https://pricing.snapeda.com/search/part/ABS07-32.768KHZ-7-T/?ref=eda; Part Number: SC32S-7PF20PPM
Q4 Q5 Q7-Q15 = NMOS: MPN: *
S1 S2 = KMS231GLFS: Part Number: KMS231GLFS; MPN: KMS231GLFS

## Nets that join several sheets
GND: usb (26 pins), ideal-diode (8 pins), battery-charging (15 pins), regulators (17 pins), prg-flash (8 pins), psram (8 pins), accelerometer (C26.2 C27.1 IC7.3), sd-card (19 pins), sensor-header (36 pins), io-headers (17 pins), jtag (5 pins), display-header (11 pins), ethernet (12 pins), wifi-bt (16 pins), mic (7 pins), ae302f (76 pins)
RAW: battery-charging (5 pins), regulators (6 pins), io-headers (D5.1 J3.2), ae302f (R59.2 R60.2)
V_BATT: ideal-diode (5 pins), battery-charging (C9.2 U2.13)
VBUS: usb (5 pins), ideal-diode (C3.2 D17.1 IC1.6), ae302f (R67.1)
VCC_1.8V: usb (B1.3 B1.6 C41.1), regulators (6 pins), accelerometer (6 pins), sd-card (R95.2), jtag (D10.1 J8.1 R49.2 R50.2), mic (B6.3 C25.1 C87.2), ae302f (18 pins)
VCC_1.8V_GATED: regulators (C2.1 C59.1 X2.A1), prg-flash (12 pins), psram (12 pins), io-headers (6 pins), ethernet (7 pins), wifi-bt (6 pins), ae302f (13 pins)
VCC_3.3V: ideal-diode (R8.1), battery-charging (R13.1 R14.1), regulators (8 pins), sd-card (C18.1 C60.1 U3.3), sensor-header (C22.1 C62.1 U6.A2), ae302f (15 pins)
VCC_3.3V_CPU: regulators (D3.3), ae302f (C115.1 C117.2 U10.T18)
VCC_3.3V_GATED: ideal-diode (D1.4), regulators (C1.1 C54.1 X1.A1 X2.B2), io-headers (8 pins), display-header (FB1.1), ethernet (L8.2), wifi-bt (7 pins), ae302f (7 pins)
VIN: ideal-diode (Q2.D), io-headers (D7.1 J6.2)
BT_D_WAKE: wifi-bt (U15.39), ae302f (U10.E14)
BT_H_WAKE: wifi-bt (R94.2 U15.38), ae302f (U10.E13)
BT_REG_ON: wifi-bt (U15.14), ae302f (U10.B18)
BT_UART_CTS_N: wifi-bt (U15.5), ae302f (U10.E6)
BT_UART_RTS_N: wifi-bt (U15.4), ae302f (U10.A9)
BT_UART_RX: wifi-bt (U15.3), ae302f (U10.M19)
BT_UART_TX: wifi-bt (U15.2), ae302f (U10.L18)
CHG: battery-charging (R1.1 R13.2 U2.9), ae302f (U10.U2)
DCMI_CLK_INT: sensor-header (B4.7), ae302f (U10.R11)
DCMI_D0_INT: sensor-header (B5.8), ae302f (U10.B7)
DCMI_D1_INT: sensor-header (B5.9), ae302f (U10.C2)
DCMI_D2_INT: sensor-header (B5.6), ae302f (U10.C3)
DCMI_D3_INT: sensor-header (B5.2), ae302f (U10.A7)
DCMI_D4_INT: sensor-header (B5.3), ae302f (U10.B4)
DCMI_D5_INT: sensor-header (B5.7), ae302f (U10.H1)
DCMI_D6_INT: sensor-header (B5.4), ae302f (U10.J2)
DCMI_D7_INT: sensor-header (B5.5), ae302f (U10.J1)
DCMI_HSYNC_INT: sensor-header (B4.2), ae302f (U10.R19)
DCMI_MISO_INT: sensor-header (B4.5), ae302f (U10.R8)
DCMI_MOSI_INT: sensor-header (B4.6), ae302f (U10.L11)
DCMI_PCLK_INT: sensor-header (B4.4), ae302f (U10.R12)
DCMI_PWDN: sensor-header (D11.1 J4.25 R42.1), ae302f (U10.T1)
DCMI_PWR_INT: sensor-header (7 pins), ae302f (U10.B10)
DCMI_RST#: sensor-header (D9.1 J4.21 R27.1), ae302f (U10.T2)
DCMI_SCL: sensor-header (D12.1 J4.32 R43.1), ae302f (U10.U1)
DCMI_SCLK_INT: sensor-header (B4.8), ae302f (U10.K12)
DCMI_SDA: sensor-header (D13.1 J4.34 R44.1), ae302f (U10.U3)
DCMI_SSEL_INT: sensor-header (B4.9 R40.1), ae302f (U10.L12)
DCMI_VSYNC_INT: sensor-header (B4.3), ae302f (U10.R13)
DEBUG_RST_N: jtag (R51.2 R53.1), ae302f (C143.2 R77.1 U10.J12)
DSI_SCL: display-header (J7.11), ae302f (D23.1 Q15.3 R92.1)
DSI_SDA: display-header (J7.12), ae302f (D21.1 Q12.3 R89.1)
ETH_INT#: ethernet (IC9.18 R36.1), ae302f (U10.L9)
ETH_LED: io-headers (R45.2), ae302f (Q8.3 R97.1)
ETH_LED_INT: ethernet (IC9.23), ae302f (Q8.2)
ETH_MDC: ethernet (IC9.11), ae302f (U10.R2)
ETH_MDIO: ethernet (IC9.10 R39.1), ae302f (U10.R1)
ETH_RST: ethernet (C65.2 IC9.24 R34.1), ae302f (U10.R6)
ETH_RXD0: ethernet (IC9.13), ae302f (U10.R5)
ETH_RXD1: ethernet (IC9.12), ae302f (U10.K8)
ETH_RXDV: ethernet (IC9.15), ae302f (U10.J9)
ETH_TXCLK: ethernet (IC9.8), ae302f (U10.P2)
ETH_TXD0: ethernet (IC9.20), ae302f (U10.A12)
ETH_TXD1: ethernet (IC9.21), ae302f (U10.E9)
ETH_TXEN: ethernet (IC9.19), ae302f (U10.A11)
INT_I2C_INT: accelerometer (IC7.4 R37.1), ae302f (U10.V3)
INT_I2C_SCL: accelerometer (IC7.1 R15.1), ae302f (U10.P15)
INT_I2C_SDA: accelerometer (IC7.5 R35.1), ae302f (U10.R15)
JTAG_TCK: jtag (FL5.4 R55.2), ae302f (U10.B17)
JTAG_TDI: jtag (FL5.5 R50.1), ae302f (U10.A18)
JTAG_TDO: jtag (FL5.3), ae302f (U10.B16)
JTAG_TMS: jtag (FL5.6 R49.1), ae302f (U10.A19)
LED_CHG: ideal-diode (D1.3), battery-charging (R1.2)
LED_PGOOD: ideal-diode (D1.2), battery-charging (R4.2)
MDI_RX_N: io-headers (J3.7), ethernet (IC9.3)
MDI_RX_P: io-headers (J3.6), ethernet (IC9.4)
MDI_TX_N: io-headers (J3.5), ethernet (IC9.5)
MDI_TX_P: io-headers (J3.4), ethernet (IC9.6)
MIC_CLK: mic (B6.1), ae302f (U10.V5)
MIC_DATA: mic (B6.2), ae302f (U10.L8)
MIPI_CSI_CLK_INT_N: sensor-header (U9.9), ae302f (U10.V16)
MIPI_CSI_CLK_INT_P: sensor-header (U9.10), ae302f (U10.W16)
MIPI_CSI_D0_INT_N: sensor-header (U9.15), ae302f (U10.V14)
MIPI_CSI_D0_INT_P: sensor-header (U9.16), ae302f (U10.W14)
MIPI_CSI_D1_INT_N: sensor-header (U9.12), ae302f (U10.V15)
MIPI_CSI_D1_INT_P: sensor-header (U9.13), ae302f (U10.W15)
MIPI_DSI_CLK_INT_N: display-header (U14.13), ae302f (U10.V10)
MIPI_DSI_CLK_INT_P: display-header (U14.12), ae302f (U10.W10)
MIPI_DSI_D0_INT_N: display-header (U14.10), ae302f (U10.V11)
MIPI_DSI_D0_INT_P: display-header (U14.9), ae302f (U10.W11)
MIPI_DSI_D1_INT_N: display-header (U14.16), ae302f (U10.V9)
MIPI_DSI_D1_INT_P: display-header (U14.15), ae302f (U10.W9)
P0_MOSI_INT: io-headers (U11.1), ae302f (U10.B3)
P1_CAN_TXD_INT: io-headers (R46.2), ae302f (U10.A10)
P1_MISO_INT: io-headers (R46.1 U11.3), ae302f (U10.B8)
P2_SCLK_INT: io-headers (U11.4), ae302f (U10.D1)
P3_CAN_RXD_INT: io-headers (R47.2), ae302f (U10.F5)
P3_SSEL_INT: io-headers (R47.1 U11.5), ae302f (U10.A8)
P4_SCL_INT: io-headers (U11.6), ae302f (U10.N15)
P5_SDA_INT: io-headers (U11.7), ae302f (U10.R10)
P6_ADC: io-headers (J2.2), ae302f (D20.1 Q10.3 R57.1 R86.1)
P7_PWM_INT: io-headers (U11.8), ae302f (U10.L15)
P8_PWM_INT: io-headers (U11.9), ae302f (U10.K15)
P9_PWM_INT: io-headers (U12.1), ae302f (U10.E8)
P10_PWM: sensor-header (R54.1), io-headers (J6.6)
P11_WAKEUP: io-headers (D15.1 J6.7), ae302f (Q5.3 R60.1)
P12_RST_N: io-headers (J6.8), ae302f (D22.1 Q14.2 R90.1)
P13_SDA_INT: io-headers (U12.4), ae302f (U10.R14)
P14_SCL_INT: io-headers (U12.5), ae302f (U10.M15)
P15_SSEL_INT: io-headers (U12.6), ae302f (U10.L1)
P16_SCLK_INT: io-headers (U12.7), ae302f (U10.J5)
P17_MISO_INT: io-headers (U12.8), ae302f (U10.G5)
P18_MOSI_INT: io-headers (U12.9), ae302f (U10.H5)
PFLASH_CS#: prg-flash (R32.2 R33.1 U7.C2), ae302f (U10.G1)
PFLASH_D0: prg-flash (U7.D3), ae302f (U10.G18)
PFLASH_D1: prg-flash (U7.D2), ae302f (U10.G15)
PFLASH_D2: prg-flash (U7.C4), ae302f (U10.L5)
PFLASH_D3: prg-flash (U7.D4), ae302f (U10.M2)
PFLASH_D4: prg-flash (U7.D5), ae302f (U10.M1)
PFLASH_D5: prg-flash (U7.E3), ae302f (U10.N1)
PFLASH_D6: prg-flash (U7.E2), ae302f (U10.N2)
PFLASH_D7: prg-flash (U7.E1), ae302f (U10.M5)
PFLASH_DQSM: prg-flash (U7.C3), ae302f (U10.P1)
PFLASH_RST#: prg-flash (U7.A4), ae302f (U10.R7)
PFLASH_SCLK_N: prg-flash (U7.B1), ae302f (U10.H2)
PFLASH_SCLK_P: prg-flash (U7.B2), ae302f (U10.B9)
PG_1V8: regulators (B3.2 R16.1 X1.B2), ae302f (U10.V2)
PGOOD: ideal-diode (Q3.2), battery-charging (R4.1 R14.2 U2.7), ae302f (U10.V1)
PMIC_ONOFF: io-headers (D8.1 J3.3), ae302f (Q4.3 R59.1)
PSRAM_CS#: psram (R18.2 R26.1 U1.A3), ae302f (U10.E2)
PSRAM_D0: psram (U1.D3), ae302f (U10.K19)
PSRAM_D1: psram (U1.D2), ae302f (U10.K18)
PSRAM_D2: psram (U1.C4), ae302f (U10.J15)
PSRAM_D3: psram (U1.D4), ae302f (U10.H15)
PSRAM_D4: psram (U1.D5), ae302f (U10.G19)
PSRAM_D5: psram (U1.E3), ae302f (U10.H19)
PSRAM_D6: psram (U1.E2), ae302f (U10.H18)
PSRAM_D7: psram (U1.E1), ae302f (U10.J19)
PSRAM_DQSM: psram (U1.C3), ae302f (U10.L19)
PSRAM_RST#: psram (U1.A4), ae302f (U10.G2)
PSRAM_SCLK_N: psram (U1.B1), ae302f (U10.A6)
PSRAM_SCLK_P: psram (U1.B2), ae302f (U10.B6)
PWM_FSIN: sensor-header (R28.2 R54.2), io-headers (U12.18)
PWM_FSIN_INT: io-headers (U12.3), ae302f (U10.E7)
RST_N: jtag (R48.2 R52.1), ae302f (C142.2 Q13.2 R76.1 U10.U18)
SBL: usb (Q1.1 R3.1), io-headers (J9.2)
SD_CD_INT: sd-card (D18.1 J5.CD$1 R95.1), ae302f (U10.A15)
SD_CLK_INT: sd-card (U8.5), ae302f (U10.K1)
SD_CMD_INT: sd-card (U8.16), ae302f (U10.K2)
SD_DAT0_INT: sd-card (U8.3), ae302f (U10.A16)
SD_DAT1_INT: sd-card (U8.4), ae302f (U10.B14)
SD_DAT2_INT: sd-card (U8.1), ae302f (U10.E12)
SD_DAT3_INT: sd-card (U8.2), ae302f (U10.B13)
SD_PWR_INT: sd-card (C19.1 R82.2 U3.1 U8.15), ae302f (U10.A17)
SD_SEL_INT: sd-card (Q6.1 R96.2), ae302f (U10.B15)
SEUART_RX_INT: usb (B1.4), ae302f (R74.1 U10.A14)
SEUART_TX_INT: usb (B1.5), ae302f (R75.1 U10.A13)
ST: ideal-diode (IC1.8 Q3.1 R8.2), ae302f (U10.W2)
USB_D_N: usb (U4.6), ae302f (U10.V7)
USB_D_P: usb (U4.7), ae302f (U10.W7)
USB_D_SEL_INT: usb (R2.2), ae302f (U10.F18)
USB_D_SEL_SBL: usb (Q1.3 R2.1 R100.2 U4.10), ae302f (U10.B19)
WIFI_I2S_SCLK: wifi-bt (U15.11), ae302f (U10.E15)
WIFI_I2S_SDI: wifi-bt (U15.10), ae302f (U10.F19)
WIFI_I2S_SDO: wifi-bt (U15.9), ae302f (U10.E18)
WIFI_I2S_WS: wifi-bt (U15.8), ae302f (U10.D18)
WIFI_IRQ: wifi-bt (U15.26), ae302f (U10.K5)
WIFI_MISO: wifi-bt (U15.24), ae302f (U10.N5)
WIFI_MOSI: wifi-bt (U15.22), ae302f (U10.P5)
WIFI_SCLK: wifi-bt (U15.20), ae302f (U10.E5)
WIFI_SSEL: wifi-bt (R56.1 U15.25), ae302f (U10.D2)
WL_H_WAKE: wifi-bt (R93.1 U15.27), ae302f (U10.F15)
WL_REG_ON: wifi-bt (U15.28), ae302f (U10.C19)